# EAGLE design HC-SR04-SCANNER-v1-1 (EAGLE 7.7.0)
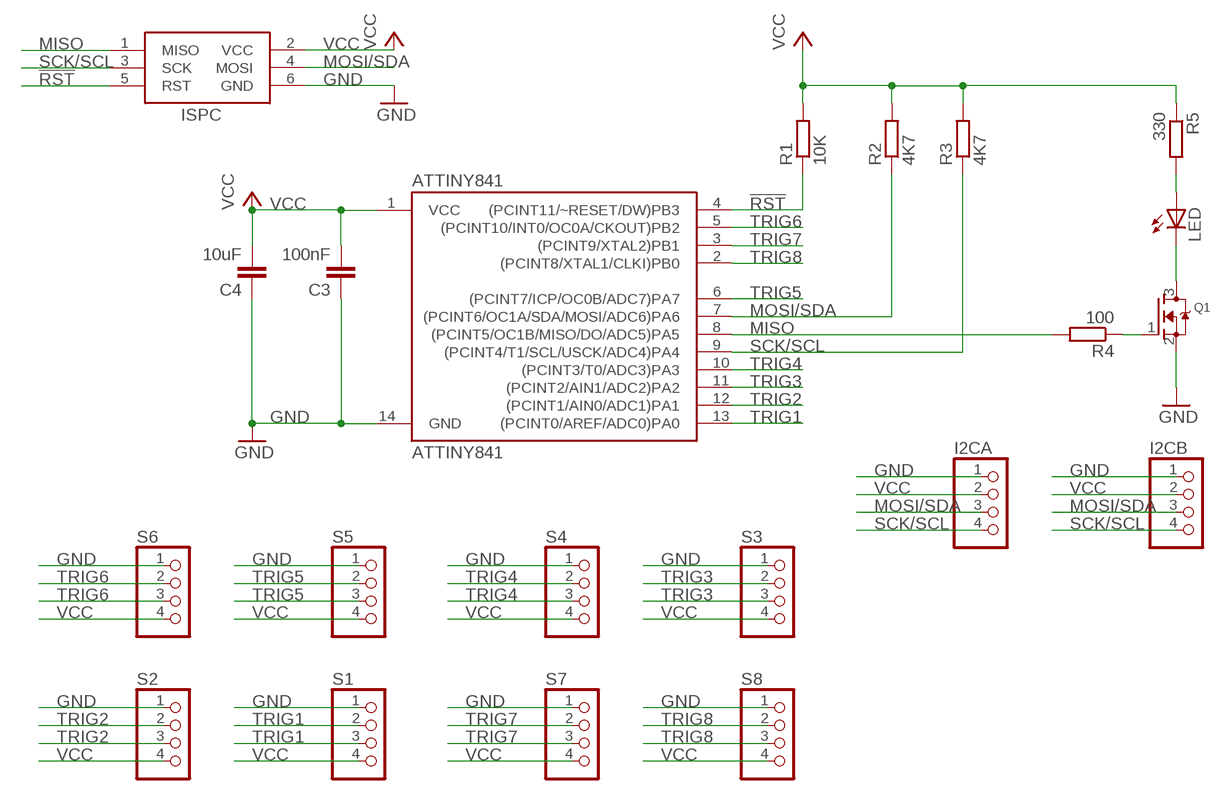
[diagram p0: schematic, sheet 1]

## Parts
ATTINY841  ATTINY841  ATTINY84  [SO14]
C3  100nF  C-EUC0805K  [C0805K]
C4  10uF  C-EUC0805K  [C0805K]
I2CA  PINHD-1X4  [1X04]
I2CB  PINHD-1X4  [1X04]
ISPC  AVRISP-6  [AVRISP]
LED  LED  [LED_0805]
Q1  MOSFET-NREFLOW  [SOT23]
R1  10K  R-EU_R0805  [R0805]
R2  4K7  R-EU_R0805  [R0805]
R3  4K7  R-EU_R0805  [R0805]
R4  100  R-EU_R0805  [R0805]
R5  330  R-EU_R0805  [R0805]
S1  PINHD-1X4  [1X04]
S2  PINHD-1X4  [1X04]
S3  PINHD-1X4  [1X04]
S4  PINHD-1X4  [1X04]
S5  PINHD-1X4  [1X04]
S6  PINHD-1X4  [1X04]
S7  PINHD-1X4  [1X04]
S8  PINHD-1X4  [1X04]

## Nets
!RST: ATTINY841.4((PCINT11/~RESET/DW)PB3) ISPC.5(RST) R1.1
GND [power]: ATTINY841.14(GND) C3.1 C4.1 I2CA.1 I2CB.1 ISPC.6(GND) Q1.2(S) S1.1 S2.1 S3.1 S4.1 S5.1 S6.1 S7.1 S8.1
MISO: ATTINY841.8((PCINT5/OC1B/MISO/DO/ADC5)PA5) ISPC.1(MISO) R4.2
MOSI/SDA: ATTINY841.7((PCINT6/OC1A/SDA/MOSI/ADC6)PA6) I2CA.3 I2CB.3 ISPC.4(MOSI) R2.1
N$1: Q1.1(G) R4.1
N$2: LED.1(A) R5.2
N$3: LED.2(C) Q1.3(D)
SCK/SCL: ATTINY841.9((PCINT4/T1/SCL/USCK/ADC4)PA4) I2CA.4 I2CB.4 ISPC.3(SCK) R3.1
TRIG1: ATTINY841.13((PCINT0/AREF/ADC0)PA0) S1.2 S1.3
TRIG2: ATTINY841.12((PCINT1/AIN0/ADC1)PA1) S2.2 S2.3
TRIG3: ATTINY841.11((PCINT2/AIN1/ADC2)PA2) S3.2 S3.3
TRIG4: ATTINY841.10((PCINT3/T0/ADC3)PA3) S4.2 S4.3
TRIG5: ATTINY841.6((PCINT7/ICP/OC0B/ADC7)PA7) S5.2 S5.3
TRIG6: ATTINY841.5((PCINT10/INT0/OC0A/CKOUT)PB2) S6.2 S6.3
TRIG7: ATTINY841.3((PCINT9/XTAL2)PB1) S7.2 S7.3
TRIG8: ATTINY841.2((PCINT8/XTAL1/CLKI)PB0) S8.2 S8.3
VCC [power]: ATTINY841.1(VCC) C3.2 C4.2 I2CA.2 I2CB.2 ISPC.2(VCC) R1.2 R2.2 R3.2 R5.1 S1.4 S2.4 S3.4 S4.4 S5.4 S6.4 S7.4 S8.4

## Library data of the parts
ATTINY841 = miller:ATTINY84: Atmel 14-pin 2/4/8kB flash uC
C3 C4 = GertSanders:C-EU: CAPACITOR, European symbol
I2CA I2CB S1-S8 = GertSanders:PINHD-1X4: PIN HEADER
ISPC = adafruit:AVRISP: AVR ISP HEADER Standard 6 pin header for AVR programming
LED = TD-MySensors:LED
Q1 = GertSanders:MOSFET-N: N-Channel Mosfet 2N7000 2N7002E - 60V 260mA SOT23 [Digikey: 2N7002ET1GOSTR-ND] - REEL BSH103 - 30V 850mA SOT23 [Digikey: 568-5013-1-ND]
R1-R5 = rcl:R-EU_: RESISTOR, European symbol

## Net classes
1 power: width 0.508 mm, clearance 0.254 mm

## Board
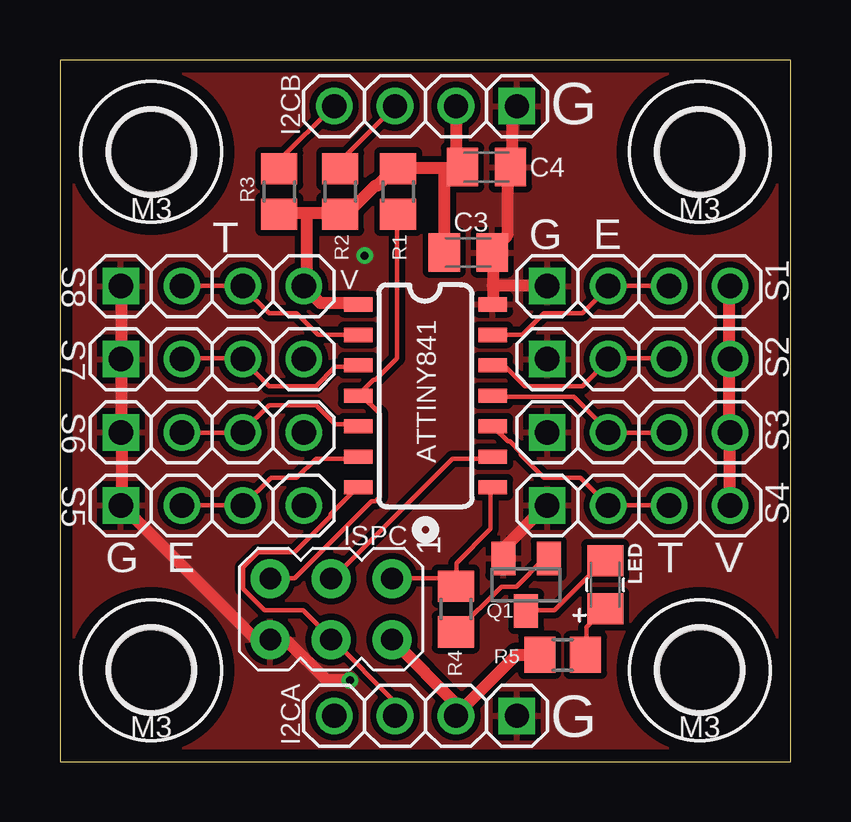
[diagram p1: board, top side]
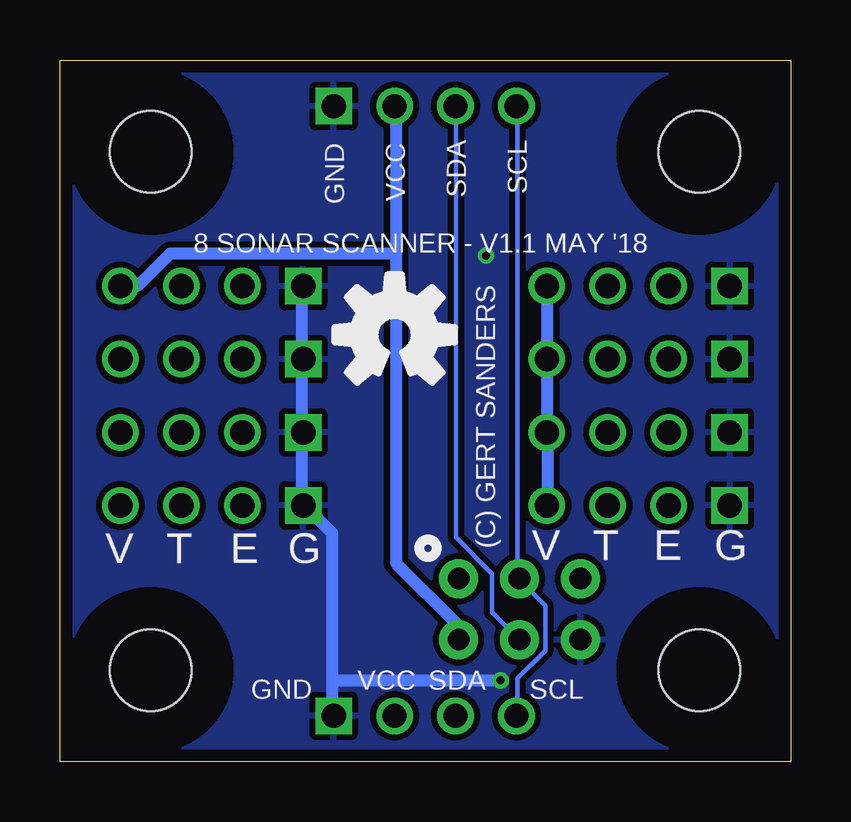
[diagram p2: board, bottom side, seen from below]

Size 30.46 x 29.23 mm. Coordinates in mm from the lower left corner, seen from the top.
Outline: 0,0 30.46,0 30.46,29.23 0,29.23 0,0
Copper layers (1*16): Top 0.035mm / dielectric 1.5011mm / Bottom 0.035mm
Design rules "Gert_Sanders": minimum track width 7mil, minimum drill 13mil, track to track 7mil, track to pad 7mil, pad to pad 7mil, via to via 7mil, smd to smd 7mil, copper to edge 20mil, drill to drill 10mil, minimum pad ring 10mil, minimum via ring 7mil, stop-mask expansion 3mil, vias tented up to drill 14mil, thermal gap 10mil

### Footprints (pad centres in the part's own frame; a part is rotated, then mirrored left to right if it is on the bottom)
SO14 = smd 0.6 x 1.2: 1 -3.81,-2.8; 2 -2.54,-2.8; 3 -1.27,-2.8; 4 0,-2.8; 5 1.27,-2.8; 6 2.54,-2.8; 7 3.81,-2.8; 8 3.81,2.8; 9 2.54,2.8; 10 1.27,2.8; 11 0,2.8; 12 -1.27,2.8; 13 -2.54,2.8; 14 -3.81,2.8
C0805K = smd 1.3 x 1.6: 1 -1,0; 2 1,0
1X04 = drill 1.016 square: 1 -3.81,0 | drill 1.016: 2 -1.27,0; 3 1.27,0; 4 3.81,0
AVRISP = drill 0.9 pad 1.626: 1 -1.27,2.54; 2 1.27,2.54; 3 -1.27,0; 4 1.27,0; 5 -1.27,-2.54; 6 1.27,-2.54
LED_0805 = smd 1.3 x 1.5: 1 -1,0; 2 1,0
SOT23 = smd 1 x 1.4: 1 -0.95,-1.1; 2 0.95,-1.1; 3 0,1.1
R0805 = smd 1.3 x 1.5: 1 -0.95,0; 2 0.95,0
HOLE_M3PAN_LOOSE = hole 3.4: 0,0

### Placement (x,y rotation side)
ATTINY841  15.24,15.24 270 top
C3  17.02,21.21 180 top
C4  17.78,24.77 180 top
I2CA  15.24,1.91 180 top
I2CB  15.24,27.3 180 top
ISPC  11.3,6.35 270 top
LED  22.73,7.37 90 top
Q1  19.43,7.37 180 top
R1  14.1,23.75 90 top
R2  11.68,23.75 270 top
R3  9.14,23.75 270 top
R4  16.51,6.35 90 top
R5  20.95,4.45 0 top
S1  24.13,19.81 0 top
S2  24.13,16.76 0 top
S3  24.13,13.72 0 top
S4  24.13,10.67 0 top
S5  6.35,10.67 0 top
S6  6.35,13.72 0 top
S7  6.35,16.76 0 top
S8  6.35,19.81 0 top
U$1  [OSHWLOGO_TOL_0.2]  16.51,17.78 0 bottom
U$2  [HOLE_M3PAN_LOOSE]  26.67,3.81 0 top
U$3  [HOLE_M3PAN_LOOSE]  3.81,3.81 0 top
U$4  [HOLE_M3PAN_LOOSE]  3.81,25.4 0 top
U$5  [HOLE_M3PAN_LOOSE]  26.67,25.4 0 top

### Tracks (layer width: path | path; a pad name or v marks a point on that pad's centre or on a via)
!RST
  Top 0.178: R1.1 14.05,22.76 14.05,16.8 13.16,15.91 13.07,15.91 12.45,15.29 ATTINY841.4 12.54,15.29 13.34,14.49 13.34,11.02 13.16,10.85 12.98,10.85 9.78,7.64 8.8,7.64 ISPC.5
GND  (via drill 0.33)
  Top 0.508: S8.1 2.58,19.74 2.58,16.98 S7.1 2.58,16.71 2.58,13.96 S6.1 2.58,13.69 2.58,10.67 S5.1 2.76,10.49 8.09,5.16 8.71,5.16 ISPC.6 8.98,4.98 9.51,4.98 11.11,3.38 v12.09,3.38 | I2CB.1 19.02,27.29 18.85,27.11 18.85,24.8 C4.1 18.67,24.54 18.67,21.96 18.14,21.43 C3.1 18.05,21.16 18.05,19.82 | 18.05,19.82 18.05,19.11 ATTINY841.14 | 18.05,19.82 20.27,19.82 S1.1 | Q1.2 18.49,8.53 18.49,8.89 20.27,10.67 S4.1
  Bottom 0.508: 19.11,3.38 19.11,9.51 20.27,10.67 S4.1 20.36,10.85 20.36,13.69 S3.1 20.36,13.96 20.36,16.71 S2.1 20.36,16.98 20.36,19.74 S1.1 | 19.11,3.38 19.11,1.96 I2CA.1 | 19.11,3.38 v12.09,3.38
  other vias: 12.7,21.08
  pour Top: -1.27,30.48 31.75,30.48 31.75,-1.27 -1.27,-1.27
  pour Bottom: -1.27,30.48 31.75,30.48 31.75,-1.27 -1.27,-1.27
MISO
  Top 0.178: 16.54,7.64 16.54,7.38 R4.2 16.54,7.64 | 16.54,7.64 16.54,8.27 17.96,9.69 17.96,11.38 ATTINY841.8 | 16.54,7.64 13.87,7.64 ISPC.1
MOSI/SDA
  Top 0.178: I2CB.3 11.73,25.07 11.73,24.71 R2.1 | ATTINY841.7 12.36,11.38 11.29,10.31 11.29,10.22 9.78,8.71 8.27,8.71 7.64,8.09 7.64,7.2 8.53,6.31 10.13,6.31 11.29,5.16 ISPC.4 11.38,5.07 13.96,2.49 13.96,1.96 I2CA.3
  Bottom 0.178: ISPC.4 12.45,6.22 12.45,7.82 13.96,9.34 13.96,27.29 I2CB.3
N$1
  Top 0.178: Q1.1 20.36,8.45 20.18,8.45 19.02,7.29 18.4,7.29 16.54,5.42 R4.1
N$2
  Top 0.178: R5.2 21.96,4.45 21.96,5.6 22.67,6.31 LED.1
N$3
  Top 0.178: Q1.3 19.47,6.31 20.62,6.31 22.67,8.36 LED.2
SCK/SCL
  Top 0.178: R3.1 9.16,24.71 9.16,25.07 11.38,27.29 I2CB.4 | ATTINY841.9 17.96,12.62 16.36,12.62 11.38,7.64 ISPC.3
  Bottom 0.178: I2CA.4 11.38,1.96 11.38,3.47 10.22,4.62 10.22,6.49 11.29,7.56 ISPC.3 11.38,7.64 11.38,27.29 I2CB.4
TRIG1
  Top 0.178: ATTINY841.13 19.29,17.78 20.18,18.67 21.78,18.67 22.85,19.74 S1.2 22.94,19.82 25.34,19.82 S1.3
TRIG2
  Top 0.178: ATTINY841.12 18.05,16.45 18.58,16.45 19.38,15.65 21.78,15.65 22.85,16.71 S2.2 22.94,16.8 25.34,16.8 S2.3
TRIG3
  Top 0.178: ATTINY841.11 18.05,15.2 21.43,15.2 22.85,13.78 S3.2 22.94,13.69 25.34,13.69 S3.3
TRIG4
  Top 0.178: ATTINY841.10 18.05,13.96 18.67,13.34 18.76,13.34 19.2,12.89 19.2,12.8 20.18,11.82 21.69,11.82 22.85,10.67 S4.2 S4.3
TRIG5
  Top 0.178: ATTINY841.6 12.36,12.62 10.67,12.62 9.87,11.82 8.8,11.82 7.64,10.67 S5.3 S5.2
TRIG6
  Top 0.178: ATTINY841.5 12.36,14.05 11.47,14.05 10.67,14.85 8.71,14.85 7.64,13.78 S6.3 7.56,13.69 5.16,13.69 S6.2
TRIG7
  Top 0.178: ATTINY841.3 12.36,16.45 11.47,16.45 10.67,15.65 8.71,15.65 7.64,16.71 S7.3 7.56,16.8 5.16,16.8 S7.2
TRIG8
  Top 0.178: ATTINY841.2 10.76,17.78 9.87,18.67 8.71,18.67 7.64,19.74 S8.3 7.56,19.82 5.16,19.82 S8.2
VCC
  Top 0.508: S4.4 27.91,10.67 27.91,13.69 S3.4 27.91,13.96 27.91,16.71 S2.4 27.91,16.98 27.91,19.74 S1.4 | R5.1 19.02,4.45 16.54,1.96 I2CA.2 16.62,2.31 13.87,5.07 ISPC.2 | 16,24.71 16.71,24.71 C4.2 16.54,24.89 16.54,27.29 I2CB.2 | 16,24.71 14.13,24.71 R1.2 13.87,24.62 13.25,24 13.16,24 11.91,22.76 R2.2 11.65,22.85 10.31,22.85 | 16,24.71 16,21.25 C3.2 | 10.31,22.85 9.16,22.85 R3.2 | ATTINY841.1 12.36,19.11 10.85,19.11 10.22,19.74 S8.4 10.31,20 10.31,22.85
  Bottom 0.508: S5.4 10.13,10.67 10.13,13.69 S6.4 10.13,13.96 10.13,16.71 S7.4 10.13,16.98 10.13,19.74 S8.4 | 16.45,21.16 16.45,27.29 I2CB.2 | 16.45,21.16 16.45,8.27 13.87,5.69 13.87,5.16 ISPC.2 | 16.45,21.16 25.87,21.16 27.2,19.82 27.91,19.82 S1.4

### Text on the board
tPlace: G | T | G | E | V | G | E | T | V | G
bPlace: SCL | SDA | VCC | GND | 8 SONAR SCANNER - V1.1 MAY '18 | (C) GERT SANDERS | G | E | T | V | G | E | T | V | SDA | VCC | SCL | GND